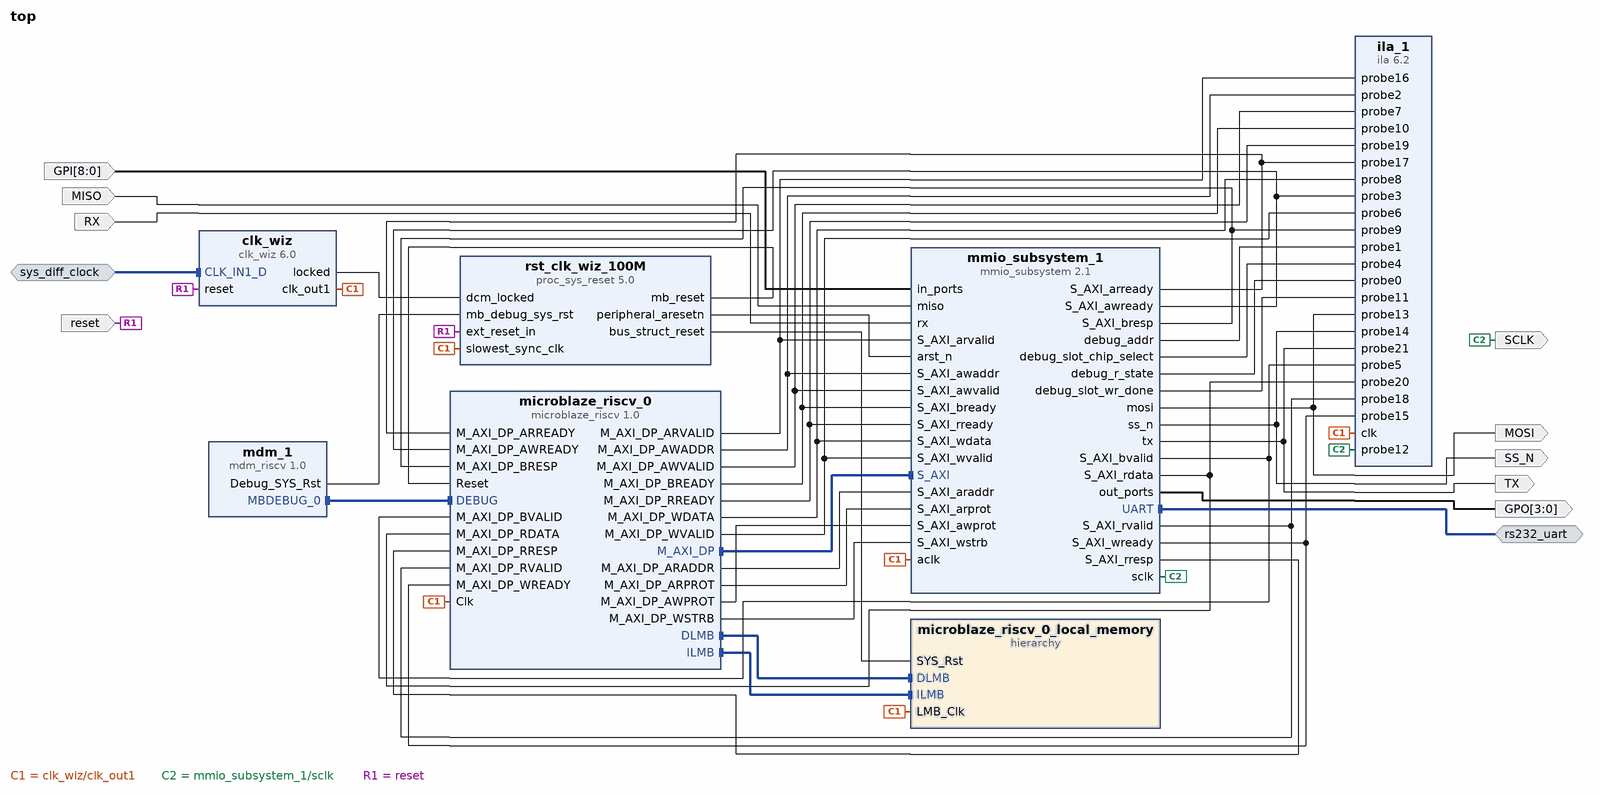
[diagram p0: block diagram of the top level]
# Vivado block design top, xc7a200tfbg676-2, Vivado 2024.2
create_bd_design top

create_bd_intf_port -mode Master -vlnv xilinx.com:interface:uart_rtl:1.0 rs232_uart
create_bd_intf_port -mode Slave -vlnv xilinx.com:interface:diff_clock_rtl:1.0 sys_diff_clock
set_property -dict {CONFIG.FREQ_HZ 200000000} [get_bd_intf_ports sys_diff_clock]
create_bd_port -dir I -type rst reset
set_property -dict {CONFIG.POLARITY ACTIVE_HIGH} [get_bd_ports reset]
create_bd_port -dir O -from 3 -to 0 GPO
create_bd_port -dir I -from 8 -to 0 GPI
create_bd_port -dir I -type data RX
create_bd_port -dir O -type data TX
create_bd_port -dir O -type clk SCLK
create_bd_port -dir O SS_N
create_bd_port -dir O -type data MOSI
create_bd_port -dir I -type data MISO

create_bd_cell -type ip -vlnv xilinx.com:ip:clk_wiz:6.0 clk_wiz
set_property -dict [list \
  CONFIG.CLKIN1_JITTER_PS 50.0 \
  CONFIG.CLKOUT1_JITTER 112.316 \
  CONFIG.CLKOUT1_PHASE_ERROR 89.971 \
  CONFIG.CLKOUT2_JITTER 112.316 \
  CONFIG.CLKOUT2_PHASE_ERROR 89.971 \
  CONFIG.CLKOUT2_REQUESTED_PHASE 1 \
  CONFIG.CLKOUT2_USED false \
  CONFIG.CLK_IN1_BOARD_INTERFACE sys_diff_clock \
  CONFIG.CLK_OUT2_PORT clk_out2 \
  CONFIG.MMCM_CLKFBOUT_MULT_F 5.000 \
  CONFIG.MMCM_CLKIN1_PERIOD 5.000 \
  CONFIG.MMCM_CLKIN2_PERIOD 10.0 \
  CONFIG.MMCM_CLKOUT1_DIVIDE 1 \
  CONFIG.NUM_OUT_CLKS 1 \
  CONFIG.PRIM_SOURCE Differential_clock_capable_pin \
  CONFIG.RESET_BOARD_INTERFACE reset \
  CONFIG.USE_BOARD_FLOW true \
] [get_bd_cells clk_wiz]
create_bd_cell -type ip -vlnv xilinx.com:ip:microblaze_riscv:1.0 microblaze_riscv_0
set_property -dict {CONFIG.C_DEBUG_ENABLED 1 CONFIG.C_D_AXI 1 CONFIG.C_D_LMB 1 CONFIG.C_I_LMB 1} [get_bd_cells microblaze_riscv_0]
create_bd_cell -type hier microblaze_riscv_0_local_memory
create_bd_cell -type ip -vlnv xilinx.com:ip:mdm_riscv:1.0 mdm_1
create_bd_cell -type ip -vlnv xilinx.com:ip:proc_sys_reset:5.0 rst_clk_wiz_100M
create_bd_cell -type ip -vlnv xilinx.com:ip:ila:6.2 ila_1
set_property -dict [list \
  CONFIG.C_MONITOR_TYPE Native \
  CONFIG.C_NUM_OF_PROBES 22 \
  CONFIG.C_PROBE0_WIDTH 3 \
  CONFIG.C_PROBE11_WIDTH 16 \
  CONFIG.C_PROBE13_WIDTH 1 \
  CONFIG.C_PROBE14_WIDTH 1 \
  CONFIG.C_PROBE1_WIDTH 8 \
  CONFIG.C_PROBE20_WIDTH 32 \
  CONFIG.C_PROBE2_WIDTH 32 \
  CONFIG.C_PROBE3_WIDTH 1 \
  CONFIG.C_PROBE4_WIDTH 16 \
  CONFIG.C_PROBE5_WIDTH 1 \
  CONFIG.C_PROBE8_WIDTH 32 \
  CONFIG.C_PROBE9_WIDTH 2 \
] [get_bd_cells ila_1]
create_bd_cell -type ip -vlnv user.org:user:mmio_subsystem:2.1 mmio_subsystem_1

# ---- hierarchy /microblaze_riscv_0_local_memory ----
current_bd_instance /microblaze_riscv_0_local_memory
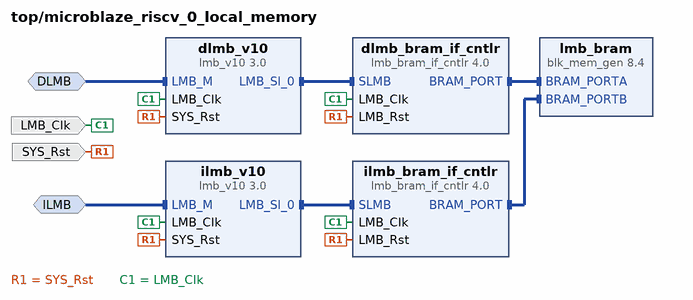
[diagram p1: block diagram inside /microblaze_riscv_0_local_memory]
create_bd_intf_pin -mode MirroredMaster -vlnv xilinx.com:interface:lmb_rtl:1.0 DLMB
create_bd_intf_pin -mode MirroredMaster -vlnv xilinx.com:interface:lmb_rtl:1.0 ILMB
create_bd_pin -dir I -type clk LMB_Clk
create_bd_pin -dir I -type rst SYS_Rst

create_bd_cell -type ip -vlnv xilinx.com:ip:lmb_v10:3.0 dlmb_v10
create_bd_cell -type ip -vlnv xilinx.com:ip:lmb_v10:3.0 ilmb_v10
create_bd_cell -type ip -vlnv xilinx.com:ip:lmb_bram_if_cntlr:4.0 dlmb_bram_if_cntlr
set_property -dict {CONFIG.C_ECC 0} [get_bd_cells dlmb_bram_if_cntlr]
create_bd_cell -type ip -vlnv xilinx.com:ip:lmb_bram_if_cntlr:4.0 ilmb_bram_if_cntlr
set_property -dict {CONFIG.C_ECC 0} [get_bd_cells ilmb_bram_if_cntlr]
create_bd_cell -type ip -vlnv xilinx.com:ip:blk_mem_gen:8.4 lmb_bram
set_property -dict {CONFIG.Memory_Type True_Dual_Port_RAM CONFIG.use_bram_block BRAM_Controller} [get_bd_cells lmb_bram]

# ---- connections ----

current_bd_instance /microblaze_riscv_0_local_memory
connect_bd_intf_net -intf_net microblaze_riscv_0_dlmb [get_bd_intf_pins dlmb_v10/LMB_M] [get_bd_intf_pins DLMB]
connect_bd_intf_net -intf_net microblaze_riscv_0_dlmb_bus [get_bd_intf_pins dlmb_v10/LMB_Sl_0] [get_bd_intf_pins dlmb_bram_if_cntlr/SLMB]
connect_bd_intf_net -intf_net microblaze_riscv_0_dlmb_cntlr [get_bd_intf_pins dlmb_bram_if_cntlr/BRAM_PORT] [get_bd_intf_pins lmb_bram/BRAM_PORTA]
connect_bd_intf_net -intf_net microblaze_riscv_0_ilmb [get_bd_intf_pins ilmb_v10/LMB_M] [get_bd_intf_pins ILMB]
connect_bd_intf_net -intf_net microblaze_riscv_0_ilmb_bus [get_bd_intf_pins ilmb_v10/LMB_Sl_0] [get_bd_intf_pins ilmb_bram_if_cntlr/SLMB]
connect_bd_intf_net -intf_net microblaze_riscv_0_ilmb_cntlr [get_bd_intf_pins ilmb_bram_if_cntlr/BRAM_PORT] [get_bd_intf_pins lmb_bram/BRAM_PORTB]
connect_bd_net [get_bd_pins SYS_Rst] \
  [get_bd_pins dlmb_v10/SYS_Rst] [get_bd_pins dlmb_bram_if_cntlr/LMB_Rst] [get_bd_pins ilmb_v10/SYS_Rst] \
  [get_bd_pins ilmb_bram_if_cntlr/LMB_Rst]
connect_bd_net -net microblaze_riscv_0_Clk [get_bd_pins LMB_Clk] \
  [get_bd_pins dlmb_v10/LMB_Clk] [get_bd_pins dlmb_bram_if_cntlr/LMB_Clk] [get_bd_pins ilmb_v10/LMB_Clk] \
  [get_bd_pins ilmb_bram_if_cntlr/LMB_Clk]
set_property HDL_ATTRIBUTE.BMM_INFO_ADDRESS_SPACE {byte  0x00000000 32 > top microblaze_riscv_0_local_memory/lmb_bram} [get_bd_cells dlmb_bram_if_cntlr]
set_property HDL_ATTRIBUTE.KEEP_HIERARCHY yes [get_bd_cells dlmb_bram_if_cntlr]

current_bd_instance /
connect_bd_intf_net [get_bd_intf_pins microblaze_riscv_0/M_AXI_DP] [get_bd_intf_pins mmio_subsystem_1/S_AXI]
connect_bd_intf_net [get_bd_intf_pins mdm_1/MBDEBUG_0] [get_bd_intf_pins microblaze_riscv_0/DEBUG]
connect_bd_intf_net [get_bd_intf_pins microblaze_riscv_0/DLMB] [get_bd_intf_pins microblaze_riscv_0_local_memory/DLMB]
connect_bd_intf_net [get_bd_intf_pins microblaze_riscv_0/ILMB] [get_bd_intf_pins microblaze_riscv_0_local_memory/ILMB]
connect_bd_intf_net [get_bd_intf_ports rs232_uart] [get_bd_intf_pins mmio_subsystem_1/UART]
connect_bd_intf_net [get_bd_intf_ports sys_diff_clock] [get_bd_intf_pins clk_wiz/CLK_IN1_D]
connect_bd_net [get_bd_ports GPI] [get_bd_pins mmio_subsystem_1/in_ports]
connect_bd_net [get_bd_ports MISO] [get_bd_pins mmio_subsystem_1/miso]
connect_bd_net [get_bd_ports RX] [get_bd_pins mmio_subsystem_1/rx]
connect_bd_net [get_bd_pins clk_wiz/clk_out1] \
  [get_bd_pins microblaze_riscv_0/Clk] [get_bd_pins microblaze_riscv_0_local_memory/LMB_Clk] \
  [get_bd_pins rst_clk_wiz_100M/slowest_sync_clk] [get_bd_pins ila_1/clk] [get_bd_pins mmio_subsystem_1/aclk]
connect_bd_net [get_bd_pins clk_wiz/locked] [get_bd_pins rst_clk_wiz_100M/dcm_locked]
connect_bd_net [get_bd_pins mdm_1/Debug_SYS_Rst] [get_bd_pins rst_clk_wiz_100M/mb_debug_sys_rst]
connect_bd_net [get_bd_pins microblaze_riscv_0/M_AXI_DP_ARADDR] [get_bd_pins mmio_subsystem_1/S_AXI_araddr]
connect_bd_net [get_bd_pins microblaze_riscv_0/M_AXI_DP_ARPROT] [get_bd_pins mmio_subsystem_1/S_AXI_arprot]
connect_bd_net [get_bd_pins microblaze_riscv_0/M_AXI_DP_ARVALID] [get_bd_pins ila_1/probe16] [get_bd_pins mmio_subsystem_1/S_AXI_arvalid]
connect_bd_net [get_bd_pins microblaze_riscv_0/M_AXI_DP_AWADDR] [get_bd_pins ila_1/probe2] [get_bd_pins mmio_subsystem_1/S_AXI_awaddr]
connect_bd_net [get_bd_pins microblaze_riscv_0/M_AXI_DP_AWPROT] [get_bd_pins mmio_subsystem_1/S_AXI_awprot]
connect_bd_net [get_bd_pins microblaze_riscv_0/M_AXI_DP_AWVALID] [get_bd_pins ila_1/probe7] [get_bd_pins mmio_subsystem_1/S_AXI_awvalid]
connect_bd_net [get_bd_pins microblaze_riscv_0/M_AXI_DP_BREADY] [get_bd_pins ila_1/probe10] [get_bd_pins mmio_subsystem_1/S_AXI_bready]
connect_bd_net [get_bd_pins microblaze_riscv_0/M_AXI_DP_RREADY] [get_bd_pins ila_1/probe19] [get_bd_pins mmio_subsystem_1/S_AXI_rready]
connect_bd_net [get_bd_pins microblaze_riscv_0/M_AXI_DP_WDATA] [get_bd_pins ila_1/probe8] [get_bd_pins mmio_subsystem_1/S_AXI_wdata]
connect_bd_net [get_bd_pins microblaze_riscv_0/M_AXI_DP_WSTRB] [get_bd_pins mmio_subsystem_1/S_AXI_wstrb]
connect_bd_net [get_bd_pins microblaze_riscv_0/M_AXI_DP_WVALID] [get_bd_pins ila_1/probe6] [get_bd_pins mmio_subsystem_1/S_AXI_wvalid]
connect_bd_net [get_bd_pins mmio_subsystem_1/S_AXI_arready] [get_bd_pins microblaze_riscv_0/M_AXI_DP_ARREADY] [get_bd_pins ila_1/probe17]
connect_bd_net [get_bd_pins mmio_subsystem_1/S_AXI_awready] [get_bd_pins microblaze_riscv_0/M_AXI_DP_AWREADY] [get_bd_pins ila_1/probe3]
connect_bd_net [get_bd_pins mmio_subsystem_1/S_AXI_bresp] [get_bd_pins microblaze_riscv_0/M_AXI_DP_BRESP] [get_bd_pins ila_1/probe9]
connect_bd_net [get_bd_pins mmio_subsystem_1/S_AXI_bvalid] [get_bd_pins microblaze_riscv_0/M_AXI_DP_BVALID] [get_bd_pins ila_1/probe5]
connect_bd_net [get_bd_pins mmio_subsystem_1/S_AXI_rdata] [get_bd_pins microblaze_riscv_0/M_AXI_DP_RDATA] [get_bd_pins ila_1/probe20]
connect_bd_net [get_bd_pins mmio_subsystem_1/S_AXI_rresp] [get_bd_pins microblaze_riscv_0/M_AXI_DP_RRESP]
connect_bd_net [get_bd_pins mmio_subsystem_1/S_AXI_rvalid] [get_bd_pins microblaze_riscv_0/M_AXI_DP_RVALID] [get_bd_pins ila_1/probe18]
connect_bd_net [get_bd_pins mmio_subsystem_1/S_AXI_wready] [get_bd_pins microblaze_riscv_0/M_AXI_DP_WREADY] [get_bd_pins ila_1/probe15]
connect_bd_net [get_bd_pins mmio_subsystem_1/debug_addr] [get_bd_pins ila_1/probe1]
connect_bd_net -net mmio_subsystem_1_debug_front_addr [get_bd_pins mmio_subsystem_1/debug_slot_chip_select] [get_bd_pins ila_1/probe4]
connect_bd_net [get_bd_pins mmio_subsystem_1/debug_r_state] [get_bd_pins ila_1/probe0]
connect_bd_net [get_bd_pins mmio_subsystem_1/debug_slot_wr_done] [get_bd_pins ila_1/probe11]
connect_bd_net [get_bd_pins mmio_subsystem_1/mosi] [get_bd_pins ila_1/probe13] [get_bd_ports MOSI]
connect_bd_net [get_bd_pins mmio_subsystem_1/out_ports] [get_bd_ports GPO]
connect_bd_net [get_bd_pins mmio_subsystem_1/sclk] [get_bd_pins ila_1/probe12] [get_bd_ports SCLK]
connect_bd_net [get_bd_pins mmio_subsystem_1/ss_n] [get_bd_pins ila_1/probe14] [get_bd_ports SS_N]
connect_bd_net [get_bd_pins mmio_subsystem_1/tx] [get_bd_pins ila_1/probe21] [get_bd_ports TX]
connect_bd_net [get_bd_ports reset] [get_bd_pins clk_wiz/reset] [get_bd_pins rst_clk_wiz_100M/ext_reset_in]
connect_bd_net [get_bd_pins rst_clk_wiz_100M/bus_struct_reset] [get_bd_pins microblaze_riscv_0_local_memory/SYS_Rst]
connect_bd_net [get_bd_pins rst_clk_wiz_100M/mb_reset] [get_bd_pins microblaze_riscv_0/Reset]
connect_bd_net [get_bd_pins rst_clk_wiz_100M/peripheral_aresetn] [get_bd_pins mmio_subsystem_1/arst_n]
set_property HDL_ATTRIBUTE.BMM_INFO_PROCESSOR {riscv > top microblaze_riscv_0_local_memory/dlmb_bram_if_cntlr} [get_bd_cells microblaze_riscv_0]
set_property HDL_ATTRIBUTE.KEEP_HIERARCHY yes [get_bd_cells microblaze_riscv_0]

# ---- address map ----
assign_bd_address -offset 0x00000000 -range 64K -target_address_space [get_bd_addr_spaces microblaze_riscv_0/Data] [get_bd_addr_segs microblaze_riscv_0_local_memory/dlmb_bram_if_cntlr/SLMB/Mem]
assign_bd_address -offset 0x46000000 -range 64K -target_address_space [get_bd_addr_spaces microblaze_riscv_0/Data] [get_bd_addr_segs mmio_subsystem_1/S_AXI/reg0]
assign_bd_address -offset 0x00000000 -range 16K -target_address_space [get_bd_addr_spaces microblaze_riscv_0/Instruction] [get_bd_addr_segs microblaze_riscv_0_local_memory/ilmb_bram_if_cntlr/SLMB/Mem]

validate_bd_design
save_bd_design
